# EAGLE design Breadboard_ProMini_v3 (EAGLE 9.6.2)
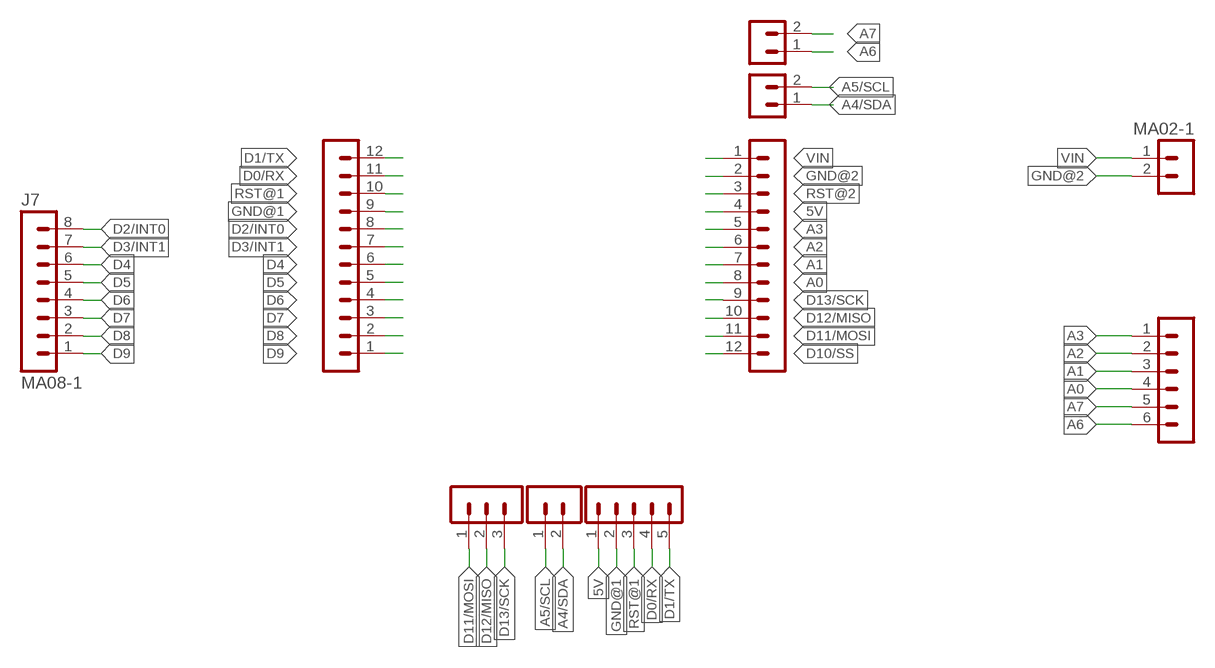
[diagram p0: schematic, sheet 1]

## Parts
J1  MA05-1  [MA05-1]
J3  MA03-1  [MA03-1]
J4  MA12-1  [MA12-1]
J5  MA02-1  [MA02-1]
J6  MA02-1  [MA02-1]
J7  MA08-1  [MA08-1]
J8  MA12-1  [MA12-1]
J9  MA02-1  [MA02-1]
J10  MA02-1  [MA02-1]
J11  MA06-1  [MA06-1]

## Nets
5V: J1.1 J8.4
A0: J8.8 J11.4
A1: J8.7 J11.3
A2: J8.6 J11.2
A3: J8.5 J11.1
A4/SDA: J6.2 J10.1
A5/SCL: J6.1 J10.2
A6: J5.1 J11.6
A7: J5.2 J11.5
D0/RX: J1.4 J4.11
D1/TX: J1.5 J4.12
D2/INT0: J4.8 J7.8
D3/INT1: J4.7 J7.7
D4: J4.6 J7.6
D5: J4.5 J7.5
D6: J4.4 J7.4
D7: J4.3 J7.3
D8: J4.2 J7.2
D9: J4.1 J7.1
D10/SS: J8.12
D11/MOSI: J3.1 J8.11
D12/MISO: J3.2 J8.10
D13/SCK: J3.3 J8.9
GND@1: J1.2 J4.9
GND@2: J8.2 J9.2
RST@1: J1.3 J4.10
RST@2: J8.3
VIN: J8.1 J9.1

## Library data of the parts
J1 = 00_marph_CON_PinRows:MA05-1: Pin Header
J3 = 00_marph_connectors_IDC:MA03-1: Pin Header
J4 J8 = 00_marph_CON_PinRows:MA12-1: Pin Header
J5 J10 = 00_marph_CON_PinRows:MA02-1: Pin Header
J6 J9 = 00_marph_connectors_IDC:MA02-1: Pin Header
J7 = 00_marph_connectors_IDC:MA08-1: Pin Header
J11 = 00_marph_connectors_IDC:MA06-1: Pin Header

## Board
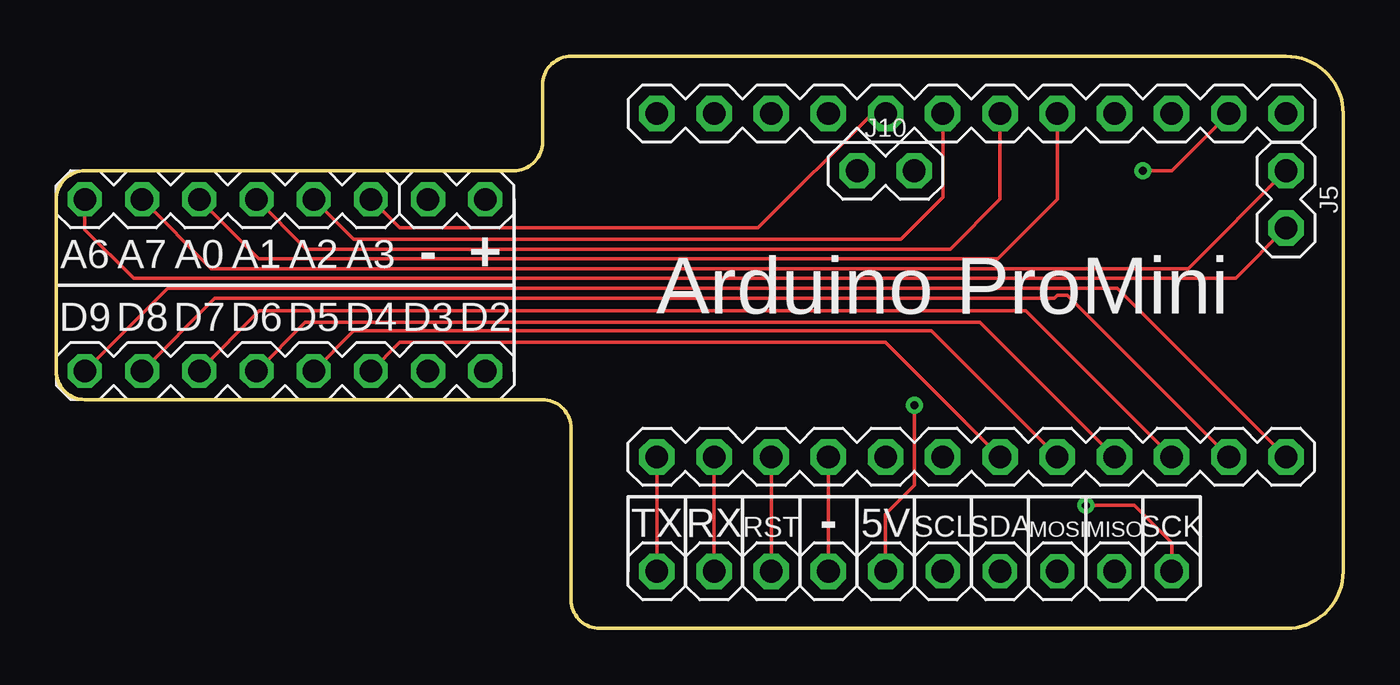
[diagram p1: board, top side]
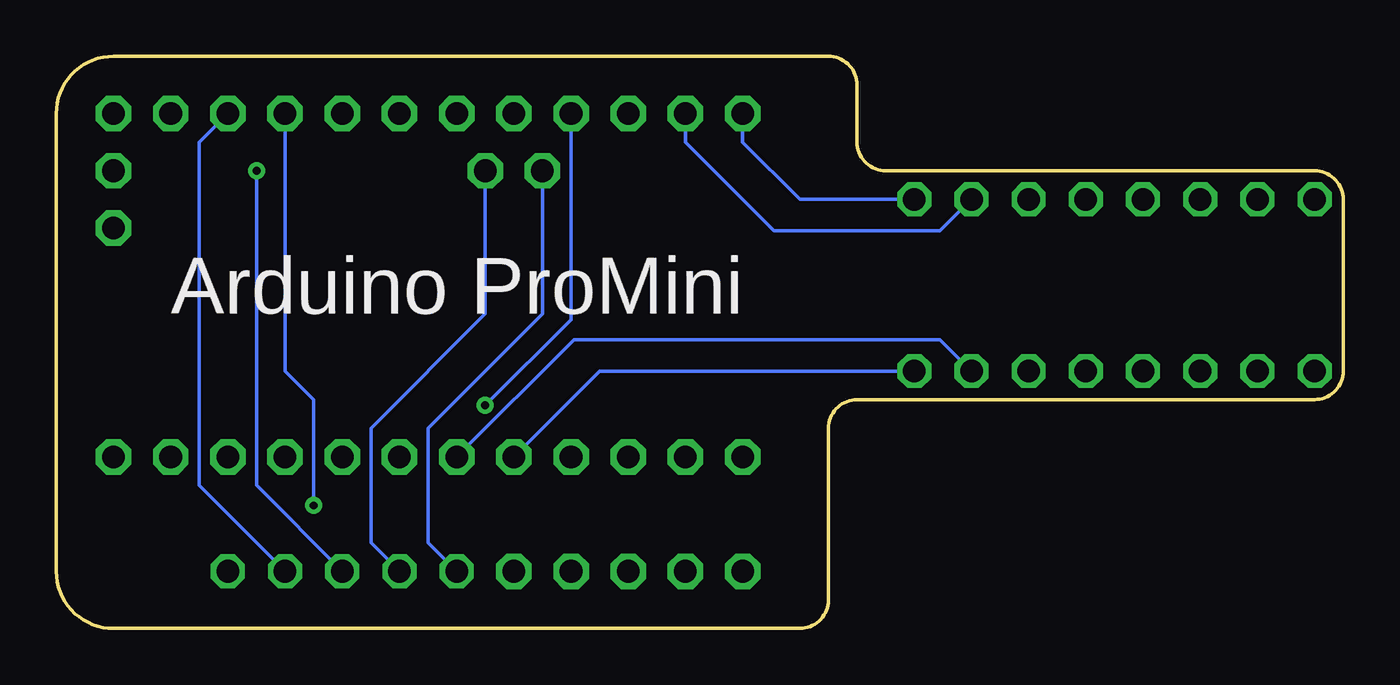
[diagram p2: board, bottom side, seen from below]

Size 57.15 x 25.4 mm. Coordinates in mm from the lower left corner, seen from the top.
Outline: 22.86,8.89 22.86,1.27 arc90 24.13,0 54.61,0 arc90 57.15,2.54 57.15,22.86 arc90 54.61,25.4 22.86,25.4 arc90 21.59,24.13 21.59,21.59 arc-90 20.32,20.32 1.27,20.32 arc90 0,19.05 0,11.43 arc90 1.27,10.16 21.59,10.16 arc-90 22.86,8.89
Copper layers (1*16): Top 0.035mm / dielectric 1.5mm / Bottom 0.035mm
Design rules "default": minimum track width 6mil, minimum drill 0.35mm, track to track 6mil, track to pad 6mil, pad to pad 6mil, via to via 6mil, smd to smd 6mil, copper to edge 40mil, drill to drill 6mil, minimum pad ring 10mil, minimum via ring 8mil, stop-mask expansion 4mil, vias tented up to drill 0mil, thermal gap 10mil

### Footprints (pad centres in the part's own frame; a part is rotated, then mirrored left to right if it is on the bottom)
MA05-1 = drill 1 pad 1.575 octagon: 1 0,5.08; 2 0,2.54; 3 0,0; 4 0,-2.54; 5 0,-5.08
MA03-1 = drill 1 octagon: 1 0,2.54; 2 0,0; 3 0,-2.54
MA12-1 = drill 1 pad 1.575 octagon: 1 0,13.97; 2 0,11.43; 3 0,8.89; 4 0,6.35; 5 0,3.81; 6 0,1.27; 7 0,-1.27; 8 0,-3.81; 9 0,-6.35; 10 0,-8.89; 11 0,-11.43; 12 0,-13.97
MA02-1 = drill 1 pad 1.575 octagon: 1 0,1.27; 2 0,-1.27
MA02-1' = drill 1 octagon: 1 0,1.27; 2 0,-1.27
MA08-1 = drill 1 octagon: 1 0,8.89; 2 0,6.35; 3 0,3.81; 4 0,1.27; 5 0,-1.27; 6 0,-3.81; 7 0,-6.35; 8 0,-8.89
MA06-1 = drill 1 octagon: 1 0,6.35; 2 0,3.81; 3 0,1.27; 4 0,-1.27; 5 0,-3.81; 6 0,-6.35

### Placement (x,y rotation side)
J1  31.75,2.54 270 top
J3  46.99,2.54 90 top
J4  40.64,7.62 270 top
J5  54.61,19.05 180 top
J6  MA02-1  [MA02-1']  40.64,2.54 90 top
J7  10.16,11.43 90 top
J8  40.64,22.86 90 top
J9  MA02-1  [MA02-1']  17.78,19.05 270 top
J10  36.83,20.32 270 top
J11  7.62,19.05 270 top

### Tracks (layer width: path | path; a pad name or v marks a point on that pad's centre or on a via)
5V  (via drill 0.35)
  Top 0.152: J1.1 36.83,5.08 38.1,6.35 v38.1,9.91
  Bottom 0.152: J8.4 34.29,13.72 v38.1,9.91
A0
  Top 0.152: J11.4 8.99,16.41 41.81,16.41 44.45,19.05 J8.8
A1
  Top 0.152: J11.3 11.1,16.84 39.7,16.84 41.91,19.05 J8.7
A2
  Top 0.152: J11.2 13.21,17.27 37.51,17.27 39.37,19.14 J8.6
A3
  Top 0.152: J11.1 15.24,17.78 31.16,17.78 36.23,22.86 J8.5
A4/SDA
  Bottom 0.152: J6.2 43.18,3.81 43.18,8.89 38.1,13.97 J10.1
A5/SCL
  Bottom 0.152: J6.1 40.64,3.81 40.64,8.89 35.56,13.97 J10.2
A6
  Top 0.152: J5.1 52.38,15.54 3.43,15.54 1.27,17.7 J11.6
A7
  Top 0.152: J11.5 6.88,15.98 50.27,15.98 J5.2
D0/RX
  Top 0.152: J1.4 J4.11
D1/TX
  Top 0.152: J1.5 J4.12
D2/INT0
  Bottom 0.152: J4.8 33.02,11.43 J7.8
D3/INT1
  Bottom 0.152: J7.7 17.91,12.83 33.02,12.83 33.53,12.83 34.16,12.83 J4.7
D4
  Top 0.152: J7.6 15.24,12.7 36.83,12.7 J4.6
D5
  Top 0.152: J7.5 13.21,13.21 38.86,13.21 J4.5
D6
  Top 0.152: J7.4 11.05,13.59 41.02,13.59 J4.4
D7
  Top 0.152: J7.3 9.02,14.1 43.05,14.1 J4.3
D8
  Top 0.152: J7.2 7.04,14.66 44.32,14.66 44.45,14.78 44.91,14.78 J4.2
D9
  Top 0.152: J7.1 4.95,15.11 47.12,15.11 J4.1
D11/MOSI  (via drill 0.35)
  Top 0.152: J8.11 49.53,20.32 v48.26,20.32
  Bottom 0.152: v48.26,20.32 48.26,6.35 J3.1
D12/MISO
  Bottom 0.152: J8.10 50.8,21.59 50.8,6.35 J3.2
D13/SCK  (via drill 0.35)
  Top 0.152: J3.3 49.53,3.81 47.88,5.46 v45.72,5.46
  Bottom 0.152: J8.9 46.99,11.43 45.72,10.16 v45.72,5.46
GND@1
  Top 0.152: J1.2 J4.9
GND@2
  Bottom 0.152: J9.2 17.91,17.65 25.27,17.65 29.21,21.59 J8.2
RST@1
  Top 0.152: J1.3 J4.10
VIN
  Bottom 0.152: J9.1 24.13,19.05 26.67,21.59 J8.1

### Text on the board
tNames: A6 | A7 | A0 | A1 | A2 | A3 | - | + | Arduino ProMini | D9 | D8 | D7 | D6 | D5 | D4 | D3 | D2 | - | TX | RX | RST | 5V | SCL | SDA | MOSI | MISO | SCK
bNames: Arduino ProMini